# EasyEDA Pro project ProDoc_PCB1_2024-11-27.epro

# Board PCB1
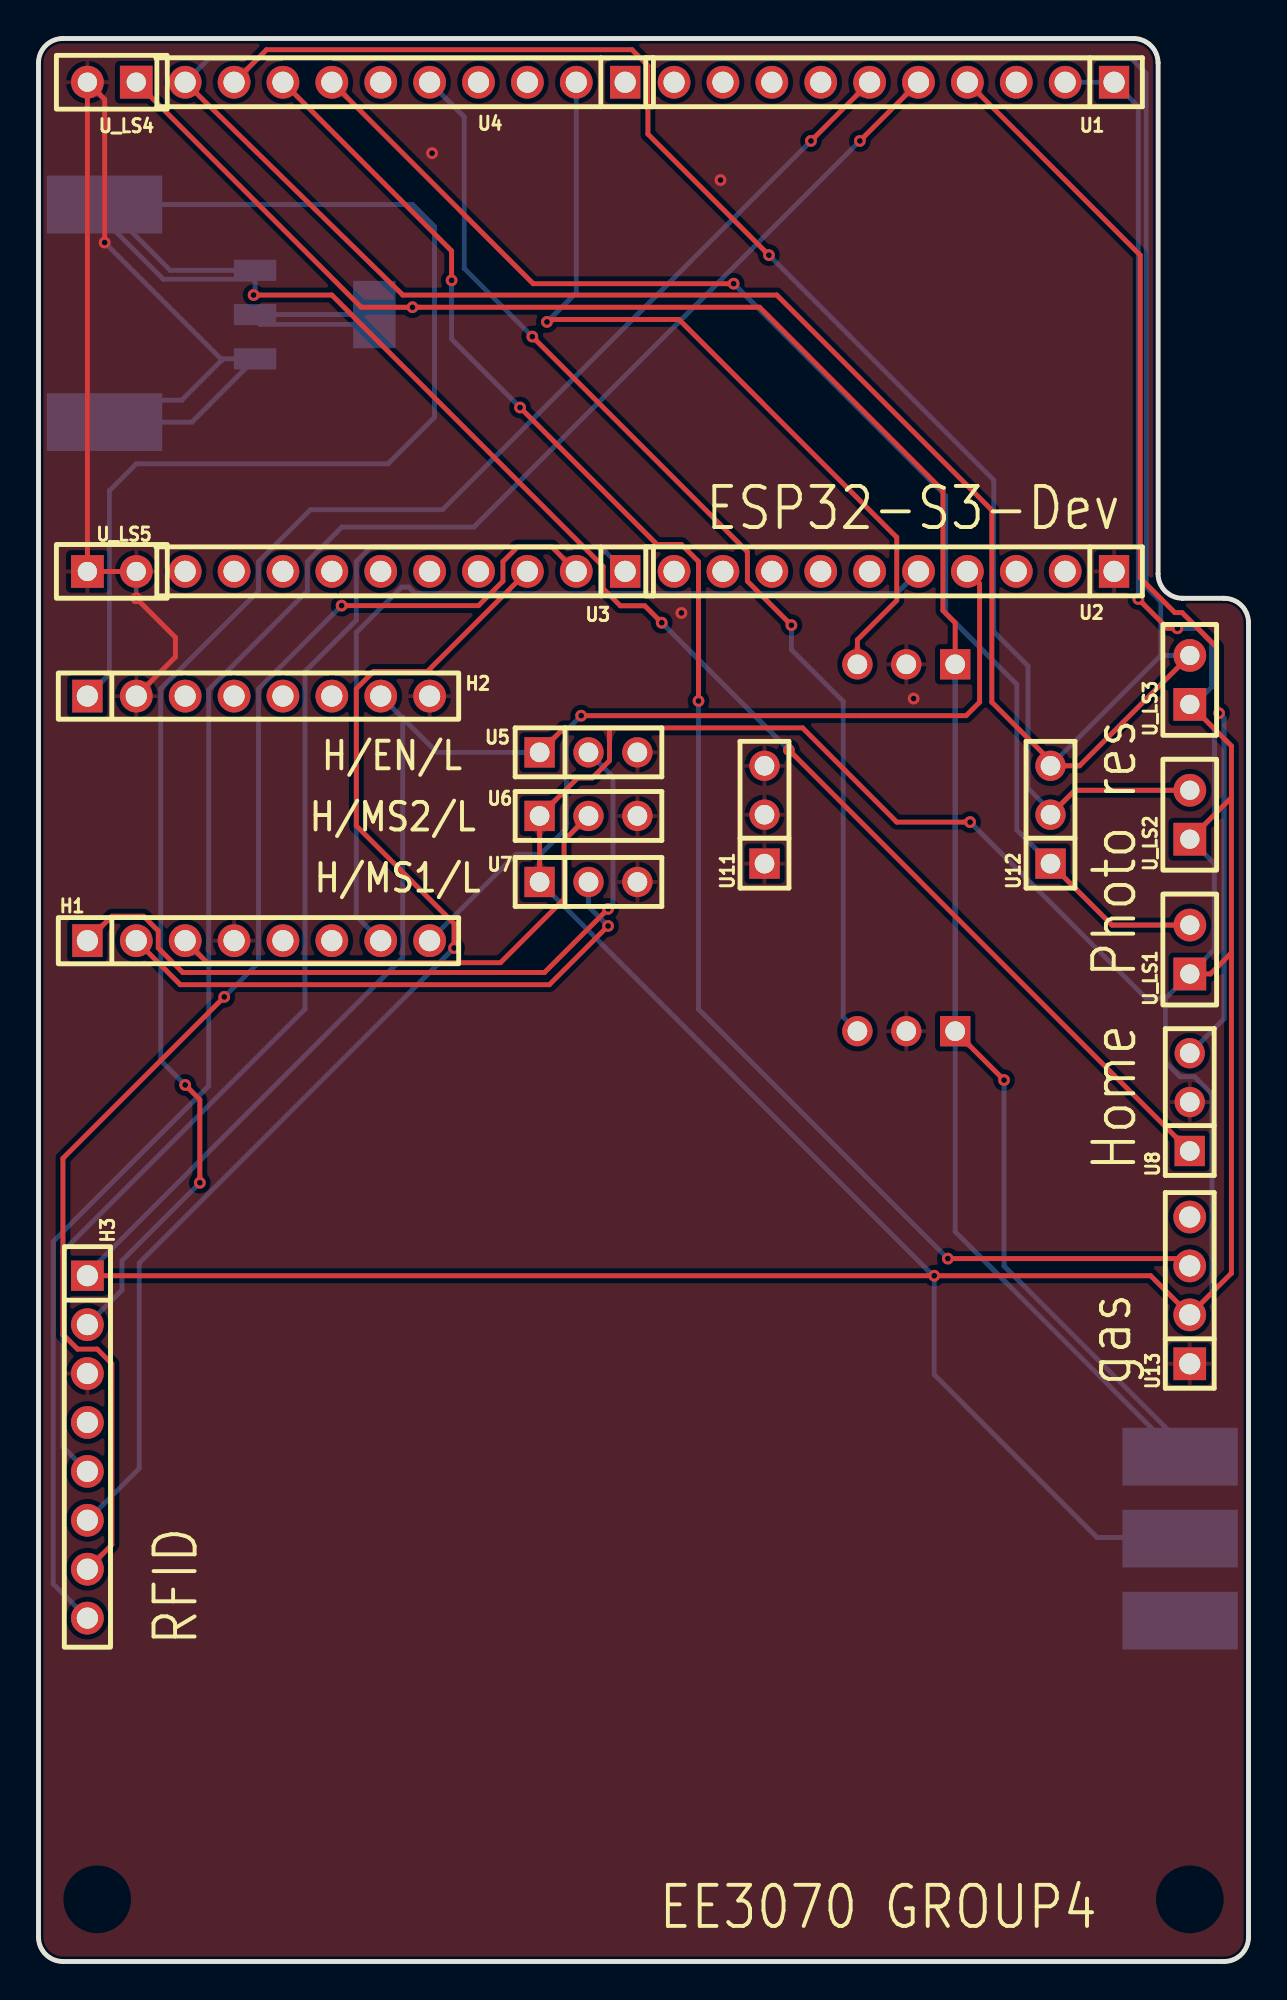
[diagram p0: board, top side]
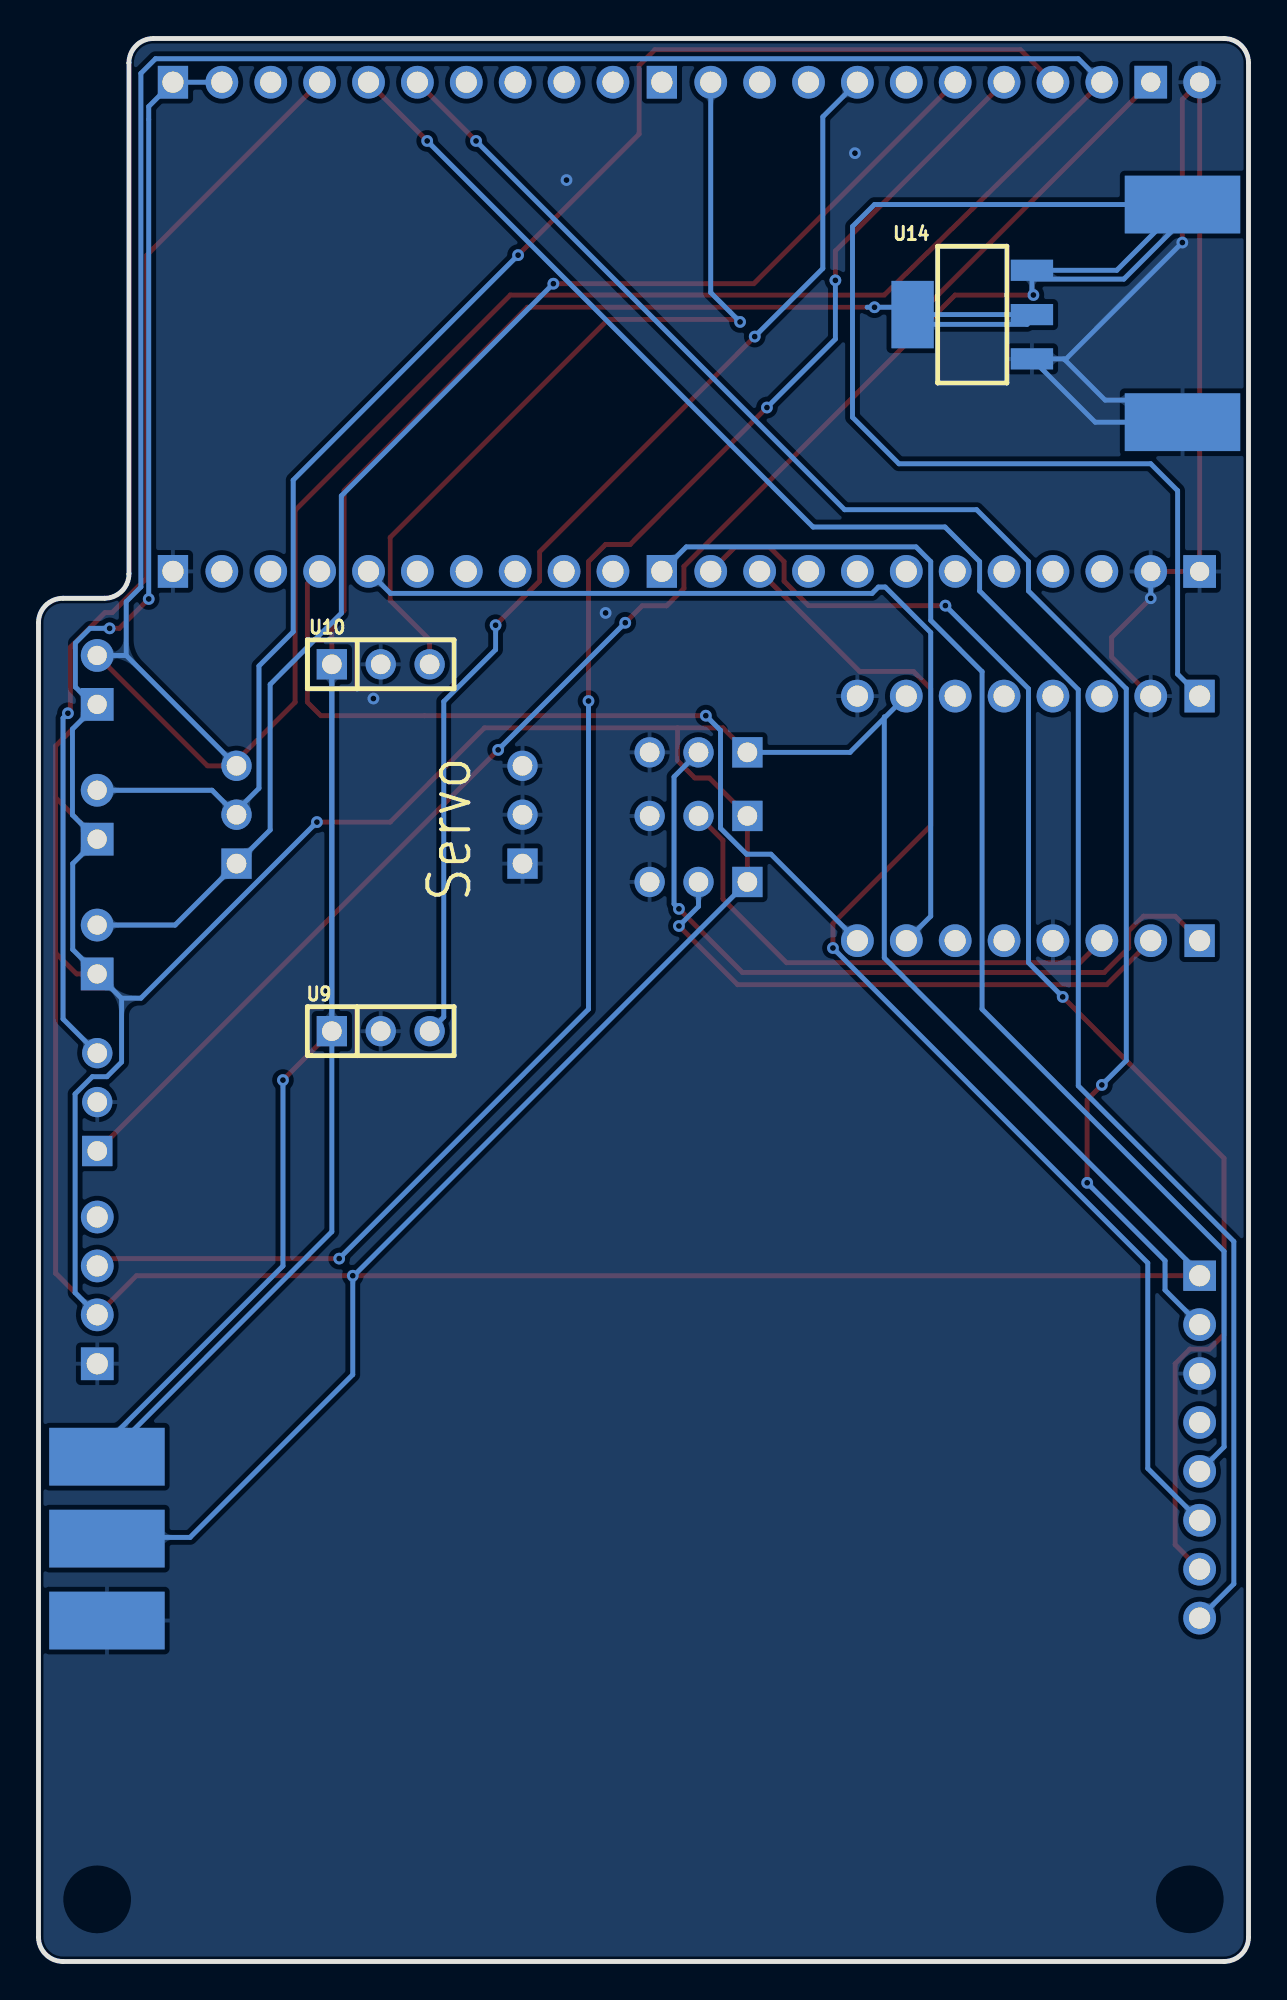
[diagram p1: board, bottom side, seen from below]

Outline 62.86 x 99.86 mm; copper layers: Top Layer, Bottom Layer. Coordinates in mm from the lower left corner of the outline.
Outline path: 0,98.59 0,1.27 arc(0.37,0.37) 1.27,0 61.59,0 arc(62.49,0.37) 62.86,1.27 62.86,69.52 arc(62.49,70.42) 61.59,70.79 59.44,70.79 arc(58.54,71.16) 58.17,72.06 58.17,98.59 arc(57.79,99.49) 56.9,99.86 1.27,99.86 arc(0.37,99.49) 0,98.59
Stack: Top Layer 0.035mm / Dielectric1 1.51mm FR4 er 4.5 / Bottom Layer 0.035mm

## Design rules (mm)
template: JLCPCB Capability(Two Layers Board)
spacing copperThickness1oz (default): track to track 0.102, other pairs 0.152 to 0.3
spacing copperThickness2oz: track to track 0.203, other pairs 0.152 to 0.3
track width copperThickness1oz (default): min 0.127, default 0.254, max 2.54
track width copperThickness2oz: min 0.203, default 0.254, max 2.54
differential pair differentialPair (default): width min 0.127, default 0.254, max 2.54; gap min 0.152, default 0.152
via viaSize (default): diameter min 0.5, default 0.61, max 10; hole min 0.3, default 0.305, max 6.3

## Placement (name value [footprint] x y rotation side)
H1  PM2.54-1*8  [HDR-TH_8P-P2.54-V-F]  11.43 53.01 0 top
H2  PM2.54-1*8  [HDR-TH_8P-P2.54-V-F]  11.43 65.71 0 top
H3  PM2.54-1*8  [HDR-TH_8P-P2.54-V-F]  2.54 26.72 270 top
NOREF  -  [Pad_e62]  3.43 91.24 0 top
NOREF#2  -  [Pad_e63]  3.43 79.93 0 top
NOREF#3  -  [Pad_e68]  59.31 26.21 0 top
NOREF#4  -  [Pad_e70]  59.31 17.7 0 top
NOREF#5  -  [Pad_e69]  59.31 21.96 0 top
U1  PM254-1-10-Z-8.5  [hdr-th_10p-p2.54-v-f]  44.45 97.59 180 top
U2  PM254-1-10-Z-8.5  [hdr-th_10p-p2.54-v-f]  44.45 72.19 180 top
U3  PM254-1-10-Z-8.5  [hdr-th_10p-p2.54-v-f]  19.05 72.19 180 top
U4  PM254-1-10-Z-8.5  [hdr-th_10p-p2.54-v-f]  19.05 97.59 180 top
U5  PM254-1-03-Z-8.5  [HDR-TH_3P-P2.54-V-F]  28.58 62.79 0 top
U6  PM254-1-03-Z-8.5  [HDR-TH_3P-P2.54-V-F]  28.58 59.49 0 top
U7  PM254-1-03-Z-8.5  [HDR-TH_3P-P2.54-V-F]  28.58 56.06 0 top
U8  PM254-1-03-Z-8.5  [HDR-TH_3P-P2.54-V-F]  59.81 44.63 90 top
U9  PM254-1-03-Z-8.5  [HDR-TH_3P-P2.54-V-F]  45.08 48.31 180 bottom
U10  PM254-1-03-Z-8.5  [HDR-TH_3P-P2.54-V-F]  45.08 67.36 180 bottom
U11  PM254-1-03-Z-8.5  [HDR-TH_3P-P2.54-V-F]  37.72 59.55 90 top
U12  PM254-1-03-Z-8.5  [HDR-TH_3P-P2.54-V-F]  52.58 59.55 90 top
U13  PM254-1-04-Z-8.5  [HDR-TH_4P-P2.54-V-M]  59.81 34.85 90 top
U14  AMS1117-5.0  [SOT-223_L6.7-W3.5-P2.30-BR]  14.35 85.52 180 bottom
U_LS1  PM254-1-02-Z-8.5  [HDR-TH_2P-P2.54-V-F]  59.82 52.55 90 top
U_LS2  PM254-1-02-Z-8.5  [HDR-TH_2P-P2.54-V-F]  59.82 59.55 90 top
U_LS3  PM254-1-02-Z-8.5  [HDR-TH_2P-P2.54-V-F]  59.82 66.55 90 top
U_LS4  PM254-1-02-Z-8.5  [HDR-TH_2P-P2.54-V-F]  3.81 97.59 180 top
U_LS5  PM254-1-02-Z-8.5  [HDR-TH_2P-P2.54-V-F]  3.81 72.18 0 top

## Footprints (pads in the part's own frame, mm; a bottom-side part is the same pattern mirrored in y, then rotated)
HDR-TH_2P-P2.54-V-F
  rect 1.7x1.7 hole 1: 1(-1.27,0)
  round 1.7 hole 1: 2(1.27,0)
HDR-TH_3P-P2.54-V-F
  rect 1.575x1.575 hole 1.02: 1(-2.54,0)
  round 1.575 hole 1.02: 2(0,0) 3(2.54,0)
HDR-TH_4P-P2.54-V-M
  rect 1.7x1.7 hole 1.1: 1(-3.81,0)
  round 1.7 hole 1.1: 2(-1.27,0) 3(1.27,0) 4(3.81,0)
HDR-TH_8P-P2.54-V-F
  rect 1.575x1.7 hole 1.1: 1(-8.89,0)
  round 1.7 hole 1.1: 2(-6.35,0) 3(-3.81,0) 4(-1.27,0) 5(1.27,0) 6(3.81,0) 7(6.35,0) 8(8.89,0)
hdr-th_10p-p2.54-v-f
  rect 1.575x1.7 hole 1.1: 1(-11.43,0)
  round 1.7 hole 1.1: 2(-8.89,0) 3(-6.35,0) 4(-3.81,0) 5(-1.27,0) 6(1.27,0) 7(3.81,0) 8(6.35,0) 9(8.89,0) 10(11.43,0)
Pad_e62
  rect 6x3 smd far side: 2(0,0)
Pad_e63
  rect 6x3 smd far side: 2(0,0)
Pad_e68
  rect 6x3 smd far side: 2(0,0)
Pad_e69
  rect 6x3 smd far side: 2(0,0)
Pad_e70
  rect 6x3 smd far side: 2(0,0)
SOT-223_L6.7-W3.5-P2.30-BR
  rect 2.2x1.1 smd: 1(3.099,-2.3) 2(3.099,0) 3(3.099,2.3)
  rect 2.2x3.5 smd: 4(-3.099,0)

## Nets
3V3: H2.7 H3.1 NOREF#5.2 U1.1 U1.2 U5.1 U6.1 U7.1 U13.2 U_LS1.1 U_LS2.1 U_LS3.1
5V: NOREF#3.2 U9.1 U10.1 U14.2 U14.4 U_LS4.1
12V: H2.1 NOREF.2 U8.1 U14.3
GND: H1.4 H2.2 H2.8 H3.3 NOREF#2.2 NOREF#4.2 U2.1 U5.3 U6.3 U7.3 U8.2 U9.2 U10.2 U11.1 U11.2 U11.3 U13.1 U14.1 U_LS4.2 U_LS5.1 U_LS5.2
DRIVER_1A: H2.5
DRIVER_1B: H2.6
DRIVER_2A: H2.4
DRIVER_2B: H2.3
DRIVER_DIR: H1.8 U2.4
DRIVER_EN: H1.1 U5.2
DRIVER_MS1: H1.2 U7.2
DRIVER_MS2: H1.3 U6.2
DRIVER_STEP: H1.7 U2.5
ESP32_GPIO0: U3.4
ESP32_GPIO3: U4.3
ESP32_GPIO4: U1.4 U8.3
ESP32_GPIO5: H3.8 U1.5
ESP32_GPIO6: H3.2 U1.6
ESP32_GPIO7: U1.7
ESP32_GPIO8: U4.2 U10.3
ESP32_GPIO9: U4.5 U9.3
ESP32_GPIO10: U4.6
ESP32_GPIO11: U4.7 U12.1 U_LS1.2
ESP32_GPIO12: U4.8 U13.3
ESP32_GPIO13: U4.9 U12.2 U_LS2.2
ESP32_GPIO14: U4.10 U12.3 U_LS3.2
ESP32_GPIO15: U1.8
ESP32_GPIO16: U1.9
ESP32_GPIO17: U1.10
ESP32_GPIO18: U4.1
ESP32_GPIO19: U3.10
ESP32_GPIO20: U3.9
ESP32_GPIO21: U3.8
ESP32_GPIO35: H3.6 U3.3
ESP32_GPIO36: H3.7 U3.2
ESP32_GPIO37: H3.5 U3.1
ESP32_GPIO38: U2.10
ESP32_GPIO39: U2.9
ESP32_GPIO40: U2.8
ESP32_GPIO41: U2.7
ESP32_GPIO42: U2.6
ESP32_GPIO45: U3.5
ESP32_GPIO46: U4.4
ESP32_GPIO47: U3.7
ESP32_GPIO48: U3.6
RST: U1.3
RX: U2.3
TX: U2.2

Pads without a net: H1 5 6; H3 4; U13 4

## Via types
v1: diameter 0.61, hole 0.305, Top Layer to Bottom Layer, 35 vias

## Routing (per net, layer and track width the routed paths; a pad name or vN(x,y) marks a point on that pad's centre or on a via; arc(x,y) is an arc through that point)
3V3: length 176.4
  Top Layer w0.254: 26.03,62.79 27.3,64.06 29.67,64.06 ; 29.67,64.06 29.67,62.35 28.77,61.46 28,61.46 26.03,59.49 26.03,56.06 ; 29.67,64.06 39.7,64.06 44.59,59.17 v1(48.4,59.17) ; v1(59.17,69.23) 58.66,69.23 v1(57.14,70.75)
  Bottom Layer w0.254: 58.56,50.02 57.54,50.02 v1(48.4,59.17) ; 58.56,50.02 U_LS1.1 61.09,52.55 61.09,57.01 59.83,58.27 ; 58.56,50.02 58.55,50.01 58.55,46.71 59.31,45.95 60.07,45.95 60.96,45.05 60.96,34.73 U13.2 ; v1(59.17,69.23) 60.19,69.23 60.95,68.47 60.95,66.18 59.93,65.16 ; H3.1 2.54,35.74 18.92,52.12 18.92,64.64 ; U1.1 55.88,96.91 ; v1(46.54,35.61) 46.54,30.48 54.99,22.02 59.25,22.02 NOREF#5.2 ; 59.83,58.27 U_LS2.1 ; 59.83,58.27 61.1,59.54 61.1,64 59.93,65.16 ; v1(57.14,70.75) 57.14,95.66 ; 59.93,65.16 U_LS3.1
5V: length 54.7
  Top Layer w0.254: U9.1 v1(50.17,45.77)
  Bottom Layer w0.254: 17.45,85.01 U14.4 ; 17.45,85.01 11.51,85.01 11.25,85.27 U14.2 ; 17.45,85.01 17.45,84.89 ; U9.1 U10.1 ; NOREF#3.2 59.31,25.83 59.44,25.7 59.56,25.7 59.82,25.96 59.82,26.47 50.17,36.12 v1(50.17,45.77)
  vias: v1(19.43,85.9)
12V: length 145.3
  Top Layer w0.254: v1(11.18,86.54) 15.24,86.54 29.33,72.45 29.33,71.3 30.23,70.4 31.5,70.4 v1(32.38,69.52) ; v1(38.98,62.92) U8.1
  Bottom Layer w0.254: H2.1 3.68,66.85 3.68,76.38 5.08,77.78 18.16,77.78 20.57,80.19 20.57,90.09 19.43,91.24 NOREF.2 ; NOREF.2 6.84,87.82 U14.3 11.25,87.36 ; NOREF.2 3.43,90.41 6.48,87.36 11.25,87.36 ; 11.25,87.36 11.25,86.58 11.21,86.54 v1(11.18,86.54) ; v1(32.38,69.52) v1(38.98,62.92)
GND: length 36.9
  Top Layer w0.254: H2.2 7.11,67.74 7.11,68.76 v1(5.08,70.79) ; U_LS4.2 3.44,96.69 v1(3.44,89.26)
  Bottom Layer w0.254: 9.53,83.17 v1(3.44,89.26) ; 9.53,83.17 7.45,81.08 3.88,81.08 2.98,80.18 2.98,79.93 ; 9.53,83.17 9.59,83.22 U14.1 ; 3.07,72.44 3.28,72.23 3.28,72.18 U_LS5.1 ; 3.07,79.85 2.98,79.93 ; 2.98,79.93 NOREF#2.2 ; v1(5.08,70.79) U_LS5.2
  vias: v1(20.45,93.9) v1(33.4,70.03) v1(35.43,92.51) v1(45.47,65.58)
DRIVER_DIR: length 43.9
  Top Layer w0.254: v1(28.19,64.69) 48.19,64.69 48.9,65.4 48.9,71.55 U2.4 48.26,72.04
  Bottom Layer w0.254: v1(28.19,64.69) 27.43,63.93 27.43,58.85 26.08,57.5 24.81,57.5 H1.8
DRIVER_EN: length 39.4
  Top Layer w0.254: H1.1 3.81,54.28 5.46,54.28 6.22,53.52 6.22,52.63 7.49,51.36 26.29,51.36 v1(29.59,54.66)
  Bottom Layer w0.254: v1(29.59,54.66) 29.84,54.91 29.84,61.52 U5.2
DRIVER_MS1: length 29.4
  Top Layer w0.254: H1.2 7.37,50.72 26.54,50.72 v1(29.59,53.77)
  Bottom Layer w0.254: U7.2 28.58,54.79 v1(29.59,53.77)
DRIVER_MS2: length 26.4
  Top Layer w0.254: H1.3 8.76,51.87 24,51.87 27.3,55.17 27.3,58.22 U6.2
DRIVER_STEP: length 47.3
  Bottom Layer w0.254: U2.5 44.58,71.04 19.56,71.04 19.23,71.37 18.87,71.37 16.51,69.01 16.51,54.28 H1.7
ESP32_GPIO4: length 56.9
  Top Layer w0.254: U1.4 57.24,88.61 57.24,71.84 59.04,70.05 59.41,70.05 61.21,68.25 61.21,64.95 v1(61.34,64.82)
  Bottom Layer w0.254: v1(61.34,64.82) 61.59,64.57 61.59,48.95 U8.3
ESP32_GPIO5: length 103.1
  Top Layer w0.254: v1(42.67,94.54) U1.5
  Bottom Layer w0.254: v1(42.67,94.54) 22.62,74.49 15.77,74.49 13.97,72.69 13.97,71.17 8.84,66.04 8.84,45.47 0.76,37.39 0.76,19.61 H3.8
ESP32_GPIO6: length 87.1
  Top Layer w0.254: v1(7.62,45.52) 8.38,44.75 v1(8.38,40.44) ; v1(40.13,94.54) U1.6
  Bottom Layer w0.254: v1(40.13,94.54) 20.98,75.39 14.12,75.39 11.43,72.69 11.43,71.17 6.35,66.09 6.35,46.79 v1(7.62,45.52) ; H3.2 4.34,34.87 4.34,36.39 v1(8.38,40.44)
ESP32_GPIO8: length 43.4
  Top Layer w0.254: v1(26.42,85.14) 26.54,85.27 33.27,85.27 44.59,73.95 44.59,70.68 42.55,68.63 U10.3
  Bottom Layer w0.254: v1(26.42,85.14) 27.94,86.66 U4.2
ESP32_GPIO9: length 58.5
  Top Layer w0.254: v1(39.12,69.39) 36.83,71.68 36.83,73.2 v1(25.65,84.38)
  Bottom Layer w0.254: U4.5 22.12,95.79 22.12,87.92 v1(25.65,84.38) ; U9.3 41.81,49.05 41.81,65.43 39.12,68.12 v1(39.12,69.39)
ESP32_GPIO11: length 79.3
  Top Layer w0.254: U12.1 55.77,53.82 U_LS1.2 ; U4.7 25.7,87.13 v1(36.11,87.13)
  Bottom Layer w0.254: U_LS1.2 55.77,53.82 U12.1 50.83,58.76 50.83,66.32 47.13,70.01 47.13,76.11 v1(36.11,87.13)
ESP32_GPIO12: length 88.9
  Top Layer w0.254: U4.8 21.46,88.82 v1(21.46,87.3) ; v1(25.02,80.7) 32.13,73.58 ; 32.13,73.58 32.14,73.58 ; 32.13,73.58 33.4,73.58 34.29,72.7 v1(34.29,65.46) ; v1(47.24,36.5) 59.43,36.5 U13.3
  Bottom Layer w0.254: v1(21.46,87.3) 21.46,84.25 v1(25.02,80.7) ; v1(34.29,65.46) 34.29,49.45 v1(47.24,36.5)
ESP32_GPIO13: length 85.6
  Top Layer w0.254: U12.2 53.85,60.82 U_LS2.2 ; U4.9 11.85,99.28 30.84,99.28 31.66,98.45 31.66,94.9 v1(37.95,88.61)
  Bottom Layer w0.254: U_LS2.2 53.85,60.82 52.68,59.65 ; 52.68,59.65 51.41,60.92 51.41,67.27 49.63,69.05 49.63,76.93 v1(37.95,88.61) ; 52.68,59.65 U12.2
ESP32_GPIO14: length 165.8
  Top Layer w0.254: U4.10 18.92,86.54 38.35,86.54 49.53,75.36 49.53,65.39 52.58,62.34 ; U12.3 54.09,62.09 U_LS3.2
  Bottom Layer w0.254: 58.31,67.82 U12.3 ; 58.31,67.82 58.31,70.61 57.55,71.38 57.55,98.05 56.78,98.81 8.84,98.81 U4.10 ; 58.31,67.82 U_LS3.2
ESP32_GPIO35: length 64.6
  Top Layer w0.254: v1(21.59,52.63) 21.59,53.9 16.51,58.98 16.51,66.09 17.41,66.99 20.2,66.99 U3.3
  Bottom Layer w0.254: v1(21.59,52.63) 5.23,36.27 5.23,25.6 H3.6
ESP32_GPIO36: length 72.8
  Top Layer w0.254: v1(15.75,70.41) 22.86,70.41 24.13,71.68 24.13,72.69 24.89,73.46 26.67,73.46 U3.2 ; H3.7 3.81,21.64 3.81,31.04 3.05,31.8 2.03,31.8 1.27,32.56 1.27,41.71 v1(9.65,50.09)
  Bottom Layer w0.254: v1(15.75,70.41) 11.43,66.09 11.43,51.87 v1(9.65,50.09)
ESP32_GPIO37: length 68.9
  Bottom Layer w0.254: H3.5 1.27,26.72 1.27,36.88 13.84,49.45 13.84,66.98 16.51,69.65 16.51,72.69 17.27,73.46 29.21,73.46 U3.1

## Copper pours and planes (outline as drawn; the poured copper is in the pictures)
GND on Top Layer: -8.38,104.19 73.41,104.19 73.41,-5.66 -8.38,-5.66
GND on Bottom Layer: -7.49,104.83 109.35,104.83 109.35,-2.49 -7.49,-2.49

Small or netless copper shapes (teardrops, artwork), in the pictures only: 43 on Top Layer, 71 on Bottom Layer

## Text on the board
Bottom Silkscreen Layer: Servo
Top Silkscreen Layer: H/MS2/L | H/MS1/L | H/EN/L | EE3070 GROUP4 | ESP32-S3-Dev | RFID | gas | Photo res | Home
